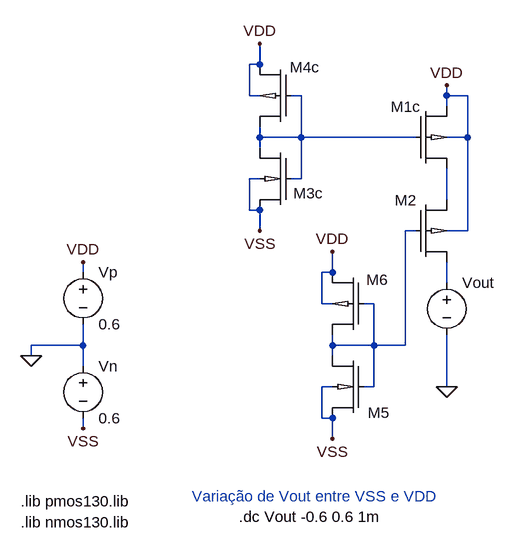
[diagram p0: schematic FiguraB_Questao5.asc]
FiguraB_Questao5.asc, the LTspice schematic file:
Version 4.1
SHEET 1 968 680
WIRE 128 -480 128 -512
WIRE 128 -480 112 -480
WIRE 112 -432 112 -480
WIRE 128 -432 112 -432
WIRE 192 -432 176 -432
WIRE 416 -432 416 -448
WIRE 448 -432 416 -432
WIRE 416 -416 416 -432
WIRE 128 -368 128 -384
WIRE 192 -368 192 -432
WIRE 192 -368 128 -368
WIRE 368 -368 192 -368
WIRE 448 -368 448 -432
WIRE 448 -368 416 -368
WIRE 128 -352 128 -368
WIRE 128 -304 112 -304
WIRE 192 -304 192 -368
WIRE 192 -304 176 -304
WIRE 416 -272 416 -320
WIRE 112 -256 112 -304
WIRE 128 -256 112 -256
WIRE 128 -224 128 -256
WIRE 368 -224 352 -224
WIRE 448 -224 448 -368
WIRE 448 -224 416 -224
WIRE -144 -160 -144 -176
WIRE 240 -160 240 -192
WIRE 240 -160 224 -160
WIRE 416 -144 416 -176
WIRE 224 -112 224 -160
WIRE 240 -112 224 -112
WIRE 304 -112 288 -112
WIRE -144 -48 -144 -80
WIRE -144 -48 -224 -48
WIRE 240 -48 240 -64
WIRE 304 -48 304 -112
WIRE 304 -48 240 -48
WIRE 352 -48 352 -224
WIRE 352 -48 304 -48
WIRE -224 -32 -224 -48
WIRE 240 -32 240 -48
WIRE -144 -16 -144 -48
WIRE 240 16 224 16
WIRE 304 16 304 -48
WIRE 304 16 288 16
WIRE 416 16 416 -64
WIRE 224 64 224 16
WIRE 240 64 224 64
WIRE -144 80 -144 64
WIRE 240 96 240 64
FLAG -224 -32 0
FLAG -144 80 VSS
FLAG -144 -176 VDD
FLAG 240 -192 VDD
FLAG 128 -512 VDD
FLAG 416 -448 VDD
FLAG 240 96 VSS
FLAG 128 -224 VSS
FLAG 416 16 0
SYMBOL voltage -144 -176 R0
WINDOW 123 0 0 Left 0
WINDOW 39 0 0 Left 0
SYMATTR InstName Vp
SYMATTR Value 0.6
SYMBOL voltage -144 -32 R0
WINDOW 123 0 0 Left 0
WINDOW 39 0 0 Left 0
SYMATTR InstName Vn
SYMATTR Value 0.6
SYMBOL pmos130 368 -416 R0
WINDOW 0 -38 1 Left 2
WINDOW 3 56 72 Invisible 2
SYMATTR InstName M1c
SYMATTR SpiceLine width=6463n length=400n
SYMBOL pmos130 368 -272 R0
WINDOW 0 -32 1 Left 2
WINDOW 3 56 72 Invisible 2
SYMATTR InstName M2
SYMATTR SpiceLine width=13460n length=400n
SYMBOL nmos130 176 -352 M0
WINDOW 0 -50 70 Left 2
WINDOW 3 56 72 Invisible 2
SYMATTR InstName M3c
SYMATTR SpiceLine width=600n length=10480n
SYMBOL nmos130 288 -32 M0
WINDOW 0 -40 88 Left 2
WINDOW 3 56 72 Invisible 2
SYMATTR InstName M5
SYMATTR SpiceLine width=600n length=4929n
SYMBOL pmos130 288 -64 R180
WINDOW 0 -38 85 Left 2
WINDOW 3 56 72 Invisible 2
SYMATTR InstName M6
SYMATTR SpiceLine width=600n length=368n
SYMBOL pmos130 176 -384 R180
WINDOW 0 -44 92 Left 2
WINDOW 3 56 72 Invisible 2
SYMATTR InstName M4c
SYMATTR SpiceLine width=1326n length=300n
SYMBOL voltage 416 -160 R0
WINDOW 3 24 96 Invisible 2
WINDOW 123 0 0 Left 0
WINDOW 39 0 0 Left 0
SYMATTR Value 0.0
SYMATTR InstName Vout
TEXT -240 192 Left 2 !.lib pmos130.lib
TEXT 96 216 Left 2 !.dc Vout -0.6 0.6 1m
TEXT 24 184 Left 2 ;Variação de Vout entre VSS e VDD
TEXT -240 224 Left 2 !.lib nmos130.lib

The netlist it stands for:
* FiguraB_Questao5.asc
Vp VDD 0 0.6
Vn 0 VSS 0.6
X§M1c VDD N001 N002 VDD pmos130 width=6463n length=400n  ; pins D G S B
X§M2 N002 N003 N004 VDD pmos130 width=13460n length=400n  ; pins D G S B
X§M3c N001 N001 VSS VSS nmos130 width=600n length=10480n  ; pins D G S B
X§M5 N003 N003 VSS VSS nmos130 width=600n length=4929n  ; pins D G S B
X§M6 N003 N003 VDD VDD pmos130 width=600n length=368n  ; pins D G S B
X§M4c N001 N001 VDD VDD pmos130 width=1326n length=300n  ; pins D G S B
Vout N004 0 0.0
.lib pmos130.lib
.dc Vout -0.6 0.6 1m
* Variação de Vout entre VSS e VDD
.lib nmos130.lib
.backanno
.end